# EAGLE schematic led_slave_1x2 (EAGLE 6.1)

## Sheet 1 of 4
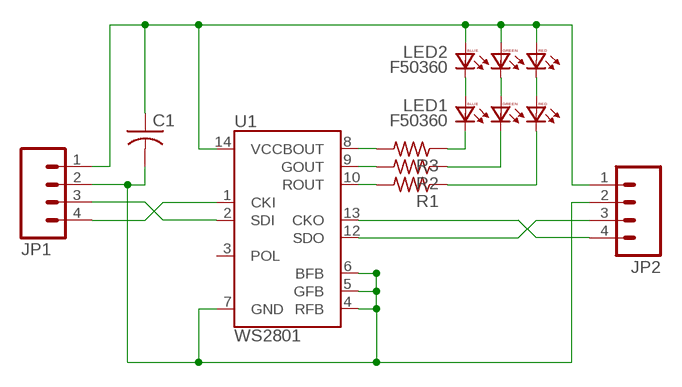
[diagram p0: schematic, sheet 1]

### Parts
C1  C-USC1206  [C1206]
JP1  M04LONGPADS  [1X04_LONGPADS]
JP2  M04LONGPADS  [1X04_LONGPADS]
LED1  F50360  [F50360]
LED2  F50360  [F50360]
R1  R-US_R1206  [R1206]
R2  R-US_R1206  [R1206]
R3  R-US_R1206  [R1206]
U1  WS2801  [SOP-14]

### Nets
N$1: JP1.3 U1.2(SDI)
N$2: JP1.4 U1.1(CKI)
N$3: JP2.4 U1.13(CKO)
N$4: JP2.3 U1.12(SDO)
N$5: R1.2 U1.10(ROUT)
N$6: R2.2 U1.9(GOUT)
N$7: R3.2 U1.8(BOUT)
N$11: LED1.BC R3.1
N$12: LED1.GC R2.1
N$15: LED1.BA LED2.BC
N$16: LED1.GA LED2.GC
N$17: LED1.RA LED2.RC
N$21: LED1.RC R1.1
N$26: C1.1 JP1.1 JP2.1 LED2.BA LED2.GA LED2.RA U1.14(VCC)
N$27: C1.2 JP1.2 JP2.2 U1.4(RFB) U1.5(GFB) U1.6(BFB) U1.7(GND)
Unconnected: U1.3(POL)

## Sheet 2 of 4
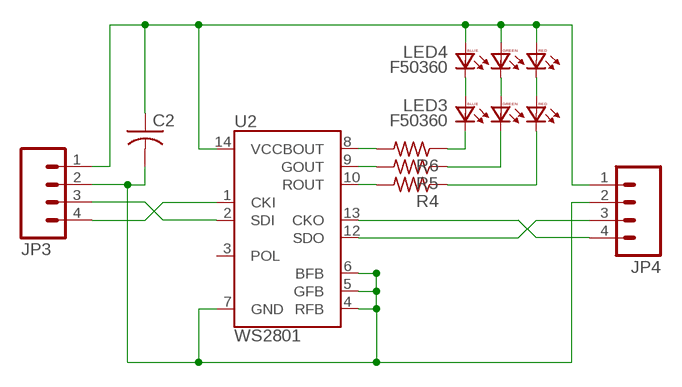
[diagram p1: schematic, sheet 2]

### Parts
C2  C-USC1206  [C1206]
JP3  M04LONGPADS  [1X04_LONGPADS]
JP4  M04LONGPADS  [1X04_LONGPADS]
LED3  F50360  [F50360]
LED4  F50360  [F50360]
R4  R-US_R1206  [R1206]
R5  R-US_R1206  [R1206]
R6  R-US_R1206  [R1206]
U2  WS2801  [SOP-14]

### Nets
N$8: JP4.4 U2.13(CKO)
N$9: JP4.3 U2.12(SDO)
N$10: LED3.BA LED4.BC
N$13: LED3.GA LED4.GC
N$14: LED3.RA LED4.RC
N$18: R4.2 U2.10(ROUT)
N$19: R5.2 U2.9(GOUT)
N$20: R6.2 U2.8(BOUT)
N$22: LED3.BC R6.1
N$23: LED3.GC R5.1
N$24: LED3.RC R4.1
N$25: JP3.3 U2.2(SDI)
N$28: JP3.4 U2.1(CKI)
N$29: C2.1 JP3.1 JP4.1 LED4.BA LED4.GA LED4.RA U2.14(VCC)
N$30: C2.2 JP3.2 JP4.2 U2.4(RFB) U2.5(GFB) U2.6(BFB) U2.7(GND)
Unconnected: U2.3(POL)

## Sheet 3 of 4
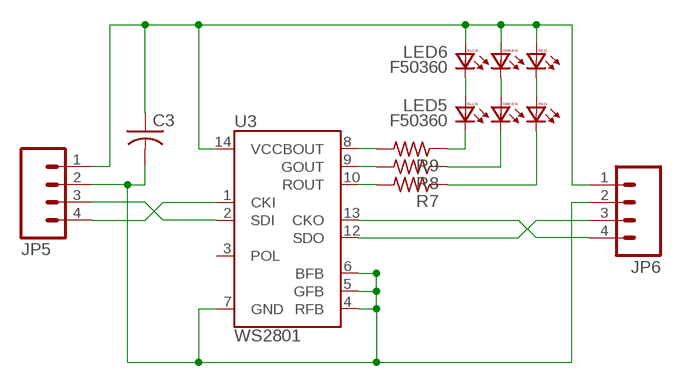
[diagram p2: schematic, sheet 3]

### Parts
C3  C-USC1206  [C1206]
JP5  M04LONGPADS  [1X04_LONGPADS]
JP6  M04LONGPADS  [1X04_LONGPADS]
LED5  F50360  [F50360]
LED6  F50360  [F50360]
R7  R-US_R1206  [R1206]
R8  R-US_R1206  [R1206]
R9  R-US_R1206  [R1206]
U3  WS2801  [SOP-14]

### Nets
N$33: JP6.4 U3.13(CKO)
N$34: JP6.3 U3.12(SDO)
N$35: LED5.BA LED6.BC
N$36: LED5.GA LED6.GC
N$37: LED5.RA LED6.RC
N$38: R7.2 U3.10(ROUT)
N$39: R8.2 U3.9(GOUT)
N$40: R9.2 U3.8(BOUT)
N$41: LED5.BC R9.1
N$42: LED5.GC R8.1
N$43: LED5.RC R7.1
N$44: JP5.3 U3.2(SDI)
N$45: JP5.4 U3.1(CKI)
N$46: C3.1 JP5.1 JP6.1 LED6.BA LED6.GA LED6.RA U3.14(VCC)
N$47: C3.2 JP5.2 JP6.2 U3.4(RFB) U3.5(GFB) U3.6(BFB) U3.7(GND)
Unconnected: U3.3(POL)

## Sheet 4 of 4
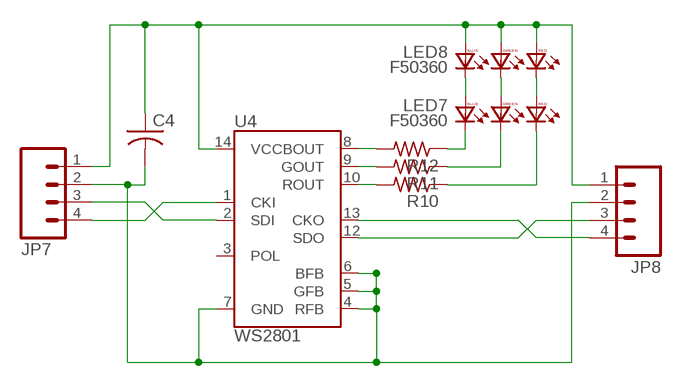
[diagram p3: schematic, sheet 4]

### Parts
C4  C-USC1206  [C1206]
JP7  M04LONGPADS  [1X04_LONGPADS]
JP8  M04LONGPADS  [1X04_LONGPADS]
LED7  F50360  [F50360]
LED8  F50360  [F50360]
R10  R-US_R1206  [R1206]
R11  R-US_R1206  [R1206]
R12  R-US_R1206  [R1206]
U4  WS2801  [SOP-14]

### Nets
N$48: JP8.4 U4.13(CKO)
N$50: JP8.3 U4.12(SDO)
N$51: LED7.BA LED8.BC
N$52: LED7.GA LED8.GC
N$53: LED7.RA LED8.RC
N$54: R10.2 U4.10(ROUT)
N$55: R11.2 U4.9(GOUT)
N$56: R12.2 U4.8(BOUT)
N$57: LED7.BC R12.1
N$58: LED7.GC R11.1
N$59: LED7.RC R10.1
N$60: JP7.3 U4.2(SDI)
N$61: JP7.4 U4.1(CKI)
N$62: C4.1 JP7.1 JP8.1 LED8.BA LED8.GA LED8.RA U4.14(VCC)
N$63: C4.2 JP7.2 JP8.2 U4.4(RFB) U4.5(GFB) U4.6(BFB) U4.7(GND)
Unconnected: U4.3(POL)

## Library data of the parts
C1-C4 = adafruit:C-US: CAPACITOR, American symbol
JP1-JP8 = sparkfun:M04: Header 4 Standard 4-pin 0.1" header. Use with straight break away headers (SKU : PRT-00116), right angle break away headers (PRT-00553), swiss pins (PRT-00743), machine pins (PRT-00117), and female headers (PRT-00115). Molex polarized connector foot print use with SKU : PRT-08231 with associated crimp pins and housings. 1MM SMD Version SKU: PRT-10208
LED1-LED8 = led:F50360: Full color Z-Power LED RGB P5-II Series Source: http://www.seoulsemicon.co.kr .. F50360.pdf
R1-R12 = adafruit:R-US_: RESISTOR, American symbol
U1-U4 = sparkfun:WS2801: WS2801 3 Channel Constant Current LED Driver with programmable PWM outputs. Datasheet: http://www.sparkfun.com/datasheets/Components/LED/WS2801.pdf